# EAGLE design DiffProbe (EAGLE 6.5.0)
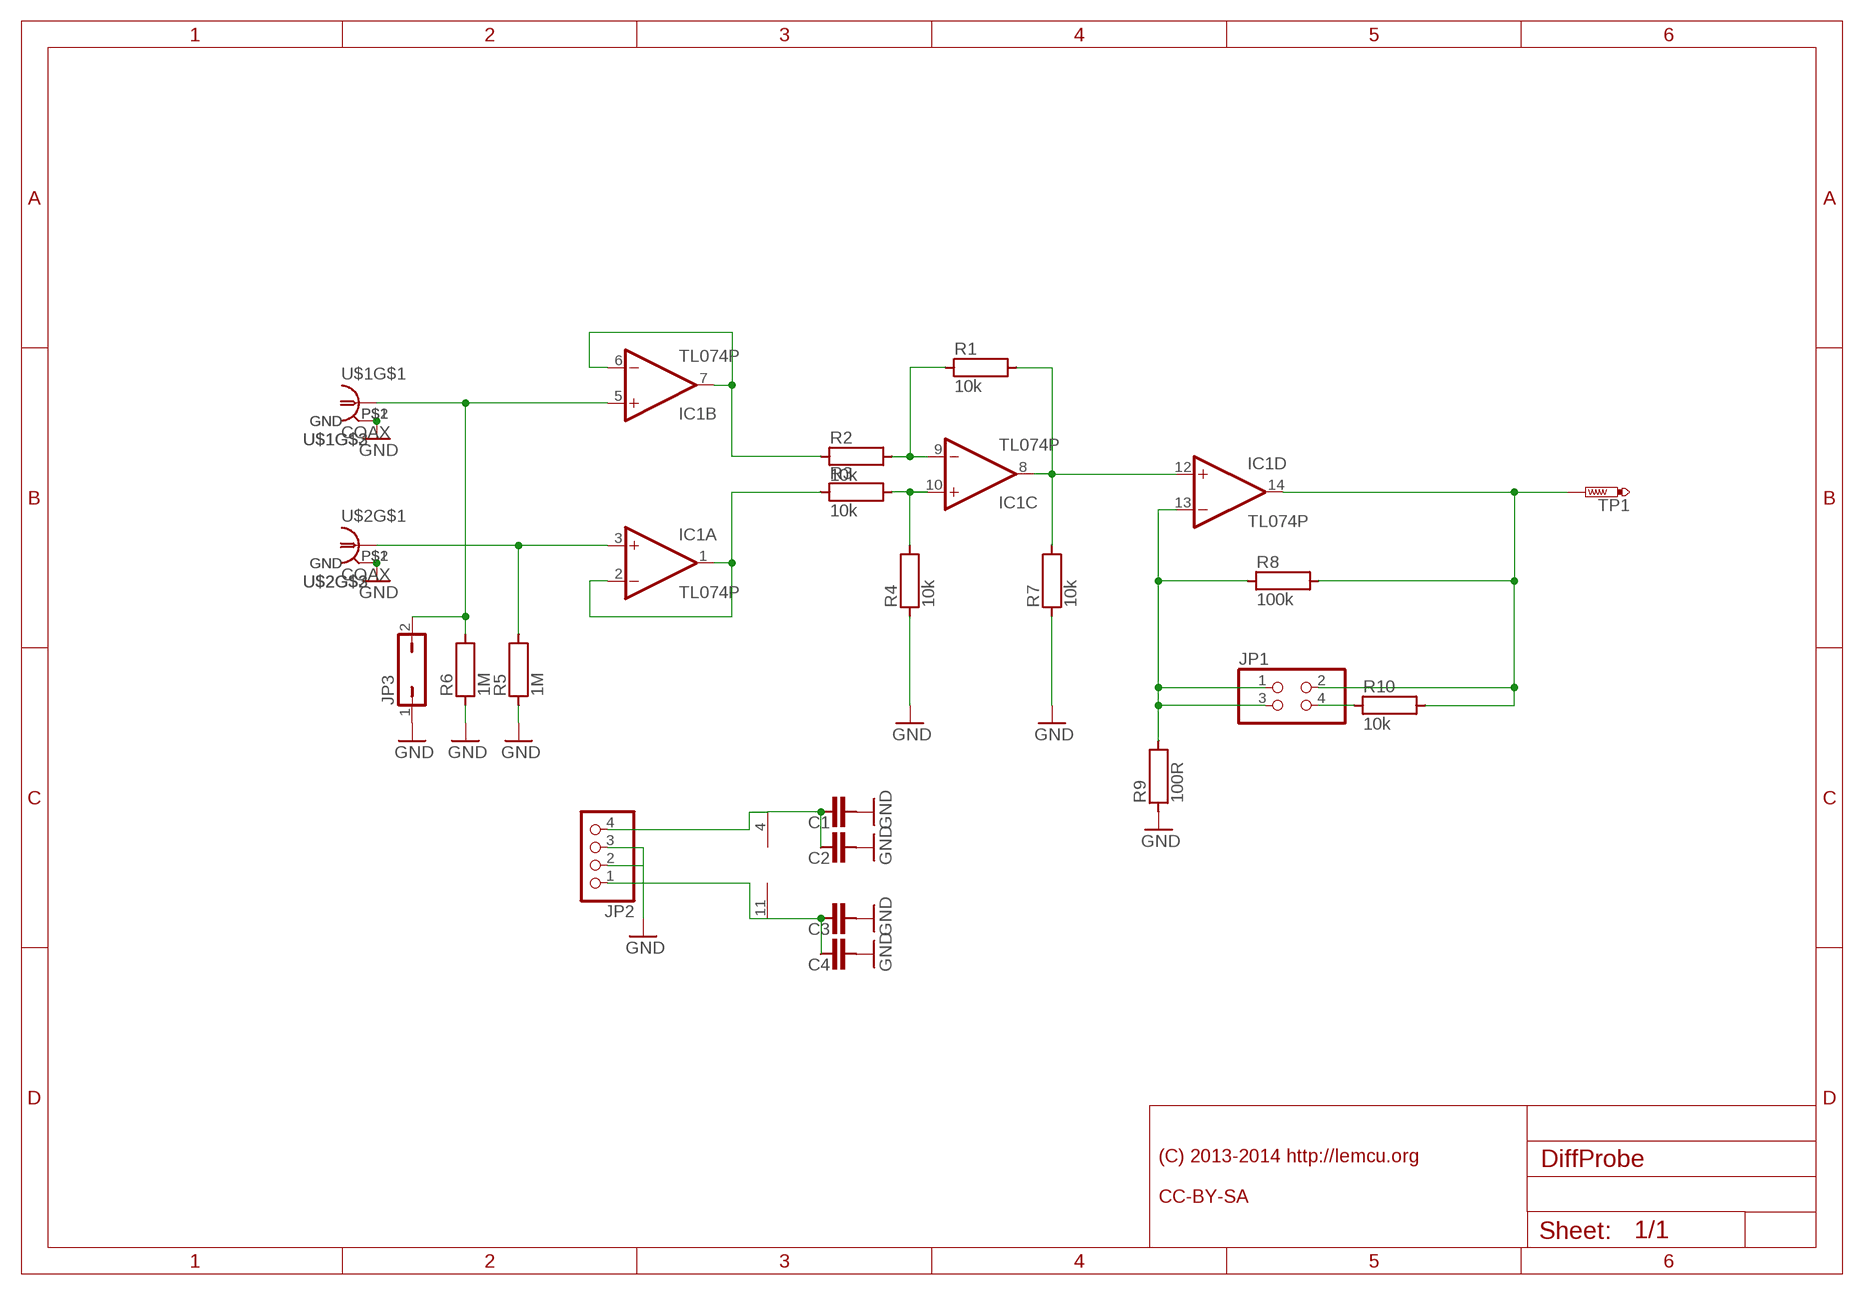
[diagram p0: schematic, sheet 1]

## Parts
C1  C0603  [C0603]
C2  C1206  [C1206]
C3  C0603  [C0603]
C4  C1206  [C1206]
IC1  TL074P  [DIL14]
JP1  PINHD-2X2  [2X02]
JP2  PINHD-1X4  [1X04]
JP3  JP1Q  [JP1]
R1  10k  R0603  [R0603]
R2  10k  R0603  [R0603]
R3  10k  R0603  [R0603]
R4  10k  R0603  [R0603]
R5  1M  R0603  [R0603]
R6  1M  R0603  [R0603]
R7  10k  R0603  [R0603]
R8  100k  R0603  [R0603]
R9  100R  R0603  [R0603]
R10  10k  R0603  [R0603]
TP1  PTR1B1,27  [B1,27]
U$1  COAX  [COAX_GND]
U$2  COAX  [COAX_GND]

## Nets
GND: C1.1 C2.1 C3.1 C4.1 JP2.2 JP2.3 JP3.1 R4.1 R5.1 R6.1 R7.1 R9.1 U$1.4(GND) U$1.P$1(GND) U$1.P$2(GND) U$2.4(GND) U$2.P$1(GND) U$2.P$2(GND)
N$1: IC1.10(C:+IN) R3.2 R4.2
N$2: IC1.9(C:-IN) R1.1 R2.2
N$3: JP1.4 R10.1
N$4: IC1.8(C:OUT) IC1.12(D:+IN) R1.2 R7.2
N$5: IC1.6(B:-IN) IC1.7(B:OUT) R2.1
N$6: IC1.1(A:OUT) IC1.2(A:-IN) R3.1
N$8: IC1.3(A:+IN) R5.2 U$2.3
N$9: IC1.5(B:+IN) JP3.2 R6.2 U$1.3
N$10: C3.2 C4.2 IC1.11(P:V-) JP2.1
N$11: C1.2 C2.2 IC1.4(P:V+) JP2.4
N$14: IC1.14(D:OUT) JP1.2 R8.2 R10.2 TP1.TP
N$20: IC1.13(D:-IN) JP1.1 JP1.3 R8.1 R9.2

## Notes on the sheet
- (C) 2013-2014 http://lemcu.org
  
  CC-BY-SA

## Library data of the parts
C1-C4 = lemcuLib:C
IC1 = linear:TL074: OP AMP
JP1 = pinhead:PINHD-2X2: PIN HEADER
JP2 = pinhead:PINHD-1X4: PIN HEADER
JP3 = jumper:JP1Q: JUMPER
R1-R10 = lemcuLib:R
TP1 = testpad:PTR1: TEST PIN
U$1 U$2 = con-coax:COAX

## Board
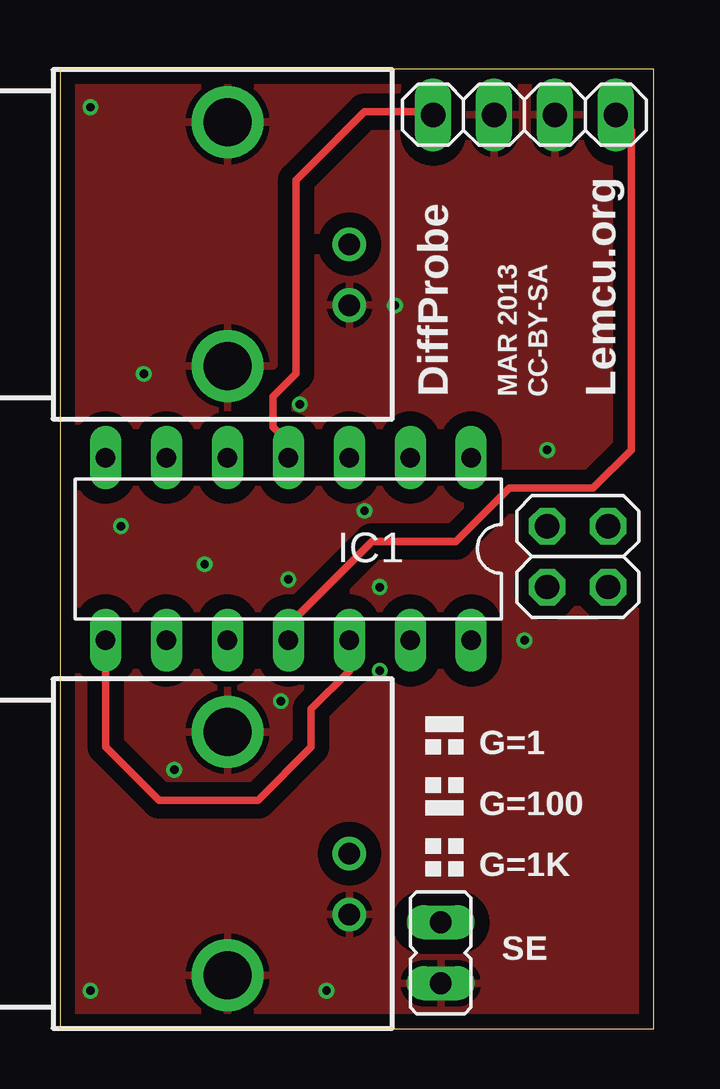
[diagram p1: board, top side]
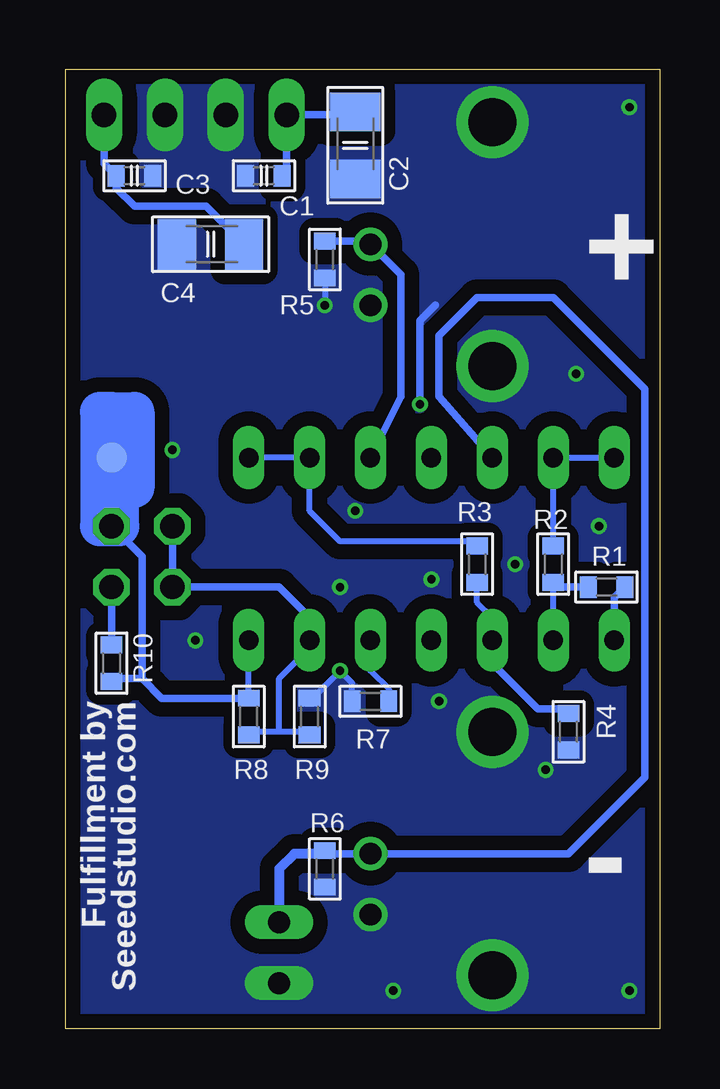
[diagram p2: board, bottom side, seen from below]

Size 24.77 x 40 mm. Coordinates in mm from the lower left corner, seen from the top.
Outline: 0,40 0,0 24.77,0 24.77,40 0,40
Copper layers (1*16): Top 0.035mm / dielectric 1.5mm / Bottom 0.035mm
Design rules "Fusion_eagle_rule_v1.1": minimum track width 6mil, minimum drill 12mil, track to track 6mil, track to pad 6mil, pad to pad 6mil, via to via 6mil, smd to smd 0mil, copper to edge 10mil, drill to drill 10mil, minimum pad ring 10mil, minimum via ring 6mil, stop-mask expansion 2mil, vias tented up to drill 100mil, thermal gap 10mil

### Footprints (pad centres in the part's own frame; a part is rotated, then mirrored left to right if it is on the bottom)
C0603 = smd 0.7 x 0.9: 1 -0.762,0; 2 0.762,0
C1206 = smd 1.6 x 2.1: 1 -1.397,0; 2 1.397,0
DIL14 = drill 0.813 long: 1 -7.62,-3.81; 2 -5.08,-3.81; 3 -2.54,-3.81; 4 0,-3.81; 5 2.54,-3.81; 6 5.08,-3.81; 7 7.62,-3.81; 8 7.62,3.81; 9 5.08,3.81; 10 2.54,3.81; 11 0,3.81; 12 -2.54,3.81; 13 -5.08,3.81; 14 -7.62,3.81
2X02 = drill 1.016 octagon: 1 -1.27,-1.27; 2 -1.27,1.27; 3 1.27,-1.27; 4 1.27,1.27
1X04 = drill 1.016 long: 1 -3.81,0; 2 -1.27,0; 3 1.27,0; 4 3.81,0
JP1 = drill 0.914 long: 1 0,-1.27; 2 0,1.27
R0603 = smd 0.7 x 0.9: 1 -0.762,0; 2 0.762,0
B1,27 = smd 1.27 x 1.27: TP 0,0
COAX_GND = drill 0.9 pad 1.27: 3 0,-5.08; 4 -2.54,-5.08 | drill 2: P$1 -5.08,0; P$2 5.08,0

### Placement (x,y rotation side)
C1  16.51,35.56 0 bottom
C2  12.7,36.83 90 bottom
C3  21.91,35.56 180 bottom
C4  18.73,32.7 0 bottom
IC1  9.53,20 180 top
JP1  21.59,19.69 270 top
JP2  19.37,38.1 180 top
JP3  15.88,3.18 0 top
R1  2.22,18.42 0 bottom
R2  4.45,19.37 270 bottom
R3  7.62,19.37 270 bottom
R4  3.81,12.38 90 bottom
R5  13.97,32.07 90 bottom
R6  13.97,6.67 90 bottom
R7  12.07,13.65 0 bottom
R8  17.14,13.02 90 bottom
R9  14.61,13.02 270 bottom
R10  22.86,15.24 270 bottom
TP1  22.86,23.81 0 bottom
U$1  6.99,7.3 90 top
U$2  6.99,32.7 90 top

### Tracks (layer width: path | path; a pad name or v marks a point on that pad's centre or on a via)
GND  (via drill 0.35)
  Bottom 0.254: R9.1 14.48,13.65 14.48,13.78 v13.34,14.92 12.83,14.41 R7.1 | R5.1 v13.97,30.16
  Bottom 0.305: v10,26.04 10,29.53 9.37,30.16
  other vias: 11.11,1.59 4.76,10.79 12.7,21.59 3.49,27.3 2.54,20.96 6.03,19.37 9.21,13.65 9.53,18.73 19.37,16.19 1.27,38.42 1.27,1.59 20.32,24.13 13.34,18.42
  pour Top (isolate 0.61): -0.32,40 -0.32,0 24.77,0 24.77,40
  pour Bottom (isolate 0.61, no thermals): -0.32,40 -0.32,0 24.77,0 24.77,40
N$1
  Bottom 0.254: IC1.10 6.99,17.14 7.62,17.78 R3.2
  Bottom 0.305: IC1.10 6.99,15.24 5.08,13.33 4,13.33 R4.2
N$2
  Bottom 0.254: IC1.9 R2.2
  Bottom 0.305: R1.1 4.25,18.42 R2.2
N$3
  Bottom 0.305: R10.1 JP1.4
N$4
  Top 0.305: IC1.8 1.91,11.75 4.13,9.53 8.26,9.53 10.48,11.75 10.48,13.33 12.07,14.92 IC1.12
  Bottom 0.254: R7.2 11.3,14.16 12.07,14.92 IC1.12
  Bottom 0.305: IC1.8 1.91,17.97 R1.2
N$5
  Bottom 0.254: R2.1 IC1.6 IC1.7
N$6
  Bottom 0.254: IC1.1 IC1.2 14.61,21.59 13.34,20.32 7.81,20.32 R3.1
N$8
  Bottom 0.305: IC1.3 10.79,26.35 10.79,31.43 U$2.3 12.19,32.83 R5.2
N$9
  Bottom 0.305: IC1.5 9.21,26.35 9.21,28.89 7.62,30.48 4.45,30.48 0.63,26.67 0.63,10.48 3.81,7.3 U$1.3 13.84,7.3 R6.2
  Bottom 0.406: 13.84,7.3 15.24,7.3 15.88,6.67 JP3.2
N$10
  Top 0.305: IC1.11 9.53,16.83 13.02,20.32 16.51,20.32 18.73,22.54 22.23,22.54 23.81,24.13 23.81,37.46 JP2.1
  Bottom 0.305: JP2.1 23.18,36.07 C3.2 22.67,35.05 21.91,34.29 18.92,34.29 C4.2
N$11
  Top 0.305: IC1.4 9.53,24.45 8.89,25.08 8.89,26.35 9.84,27.3 9.84,35.37 C2.2 15.43,38.23 JP2.4
  Bottom 0.305: C2.2 12.7,38.1 JP2.4 15.56,35.75 C1.2
N$14
  Bottom 0.254: R8.2 IC1.14
  Bottom 0.305: JP1.2 21.59,19.69 21.59,14.6 | R8.2 20.76,13.78 21.59,14.6 | 21.59,14.6 22.73,14.6 R10.2
  Bottom 1.676: JP1.2 TP1.TP 22.86,25.72 | 22.86,25.72 23.34,25.72 23.34,20.96 22.54,20.96 22.54,22.54 21.91,22.54 21.91,25.72 22.86,25.72
N$20
  Bottom 0.254: IC1.13 14.61,15.87 15.88,14.6 15.88,12.38 | 14.73,12.38 15.88,12.38 | 15.88,12.38 17.02,12.38 R8.1
  Bottom 0.305: JP1.1 JP1.3 15.88,18.42 14.61,17.14 IC1.13 | R9.2 14.73,12.38

### Text on the board
tPlace: SE
bPlace: + | -
tNames: DiffProbe | MAR 2013 | CC-BY-SA | Lemcu.org | G=1 | G=100 | G=1K
bNames: Seeedstudio.com | Fulfillment by